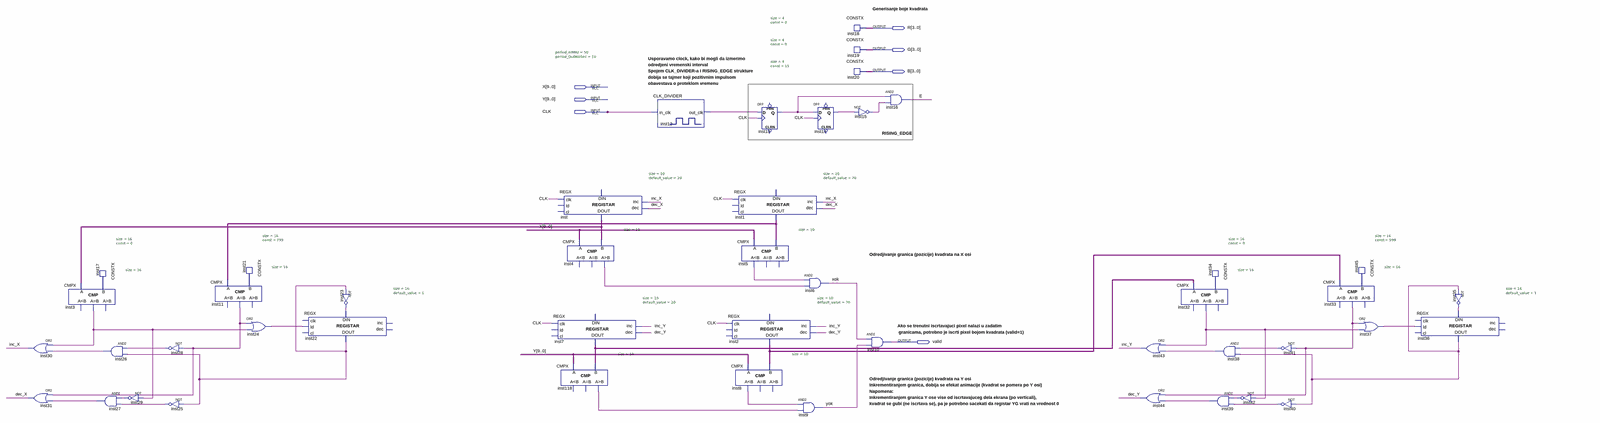
[diagram p0: schematic sheet, whole]
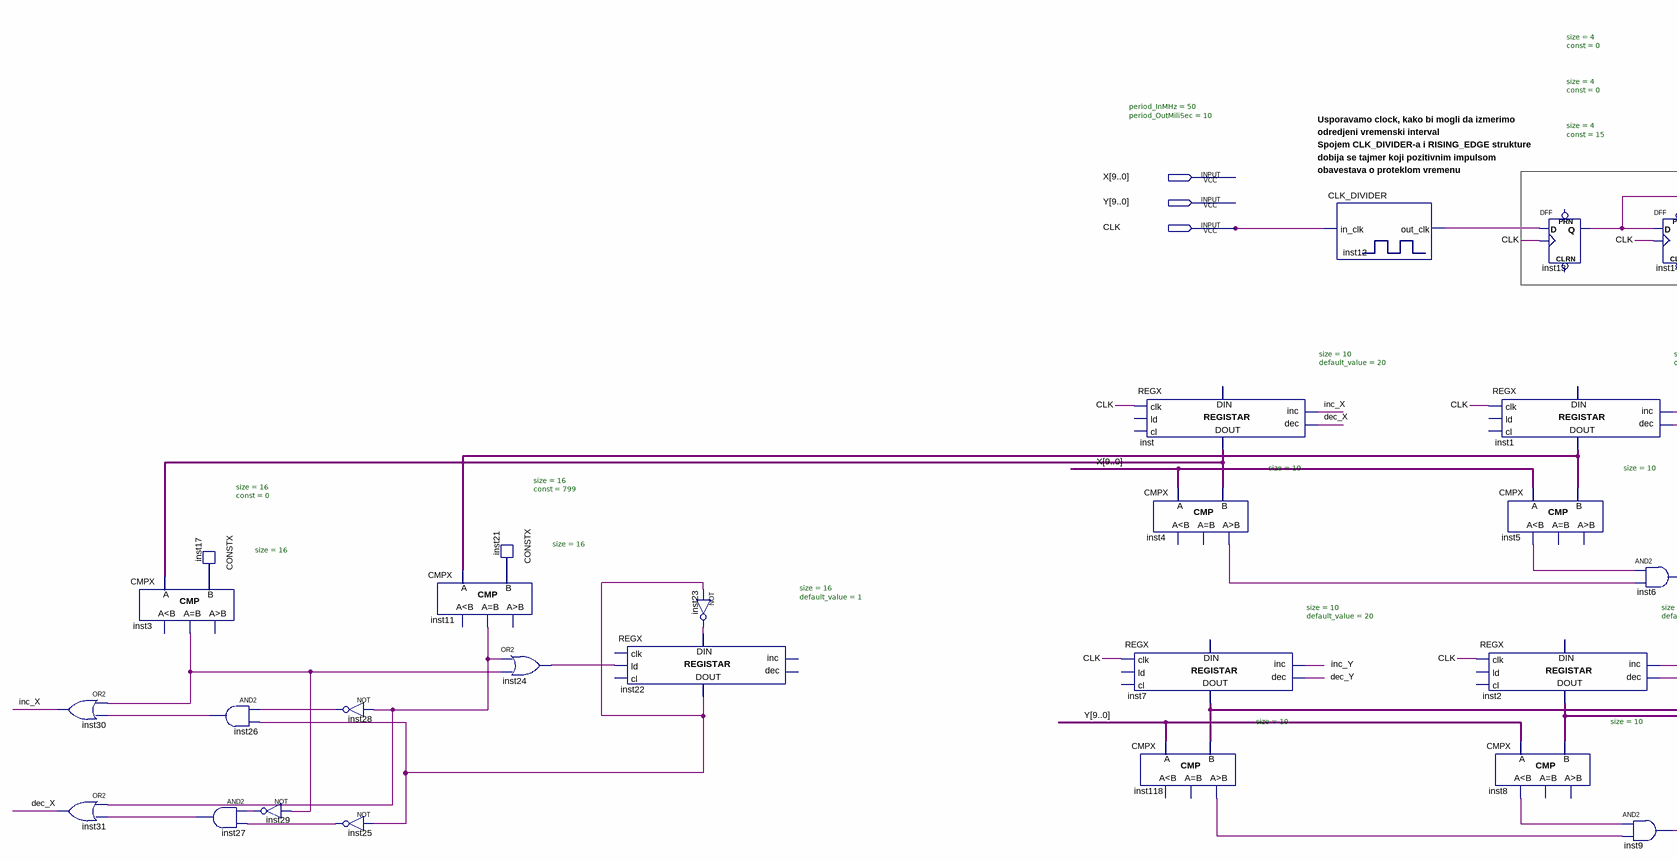
[diagram p1: schematic sheet, left part]
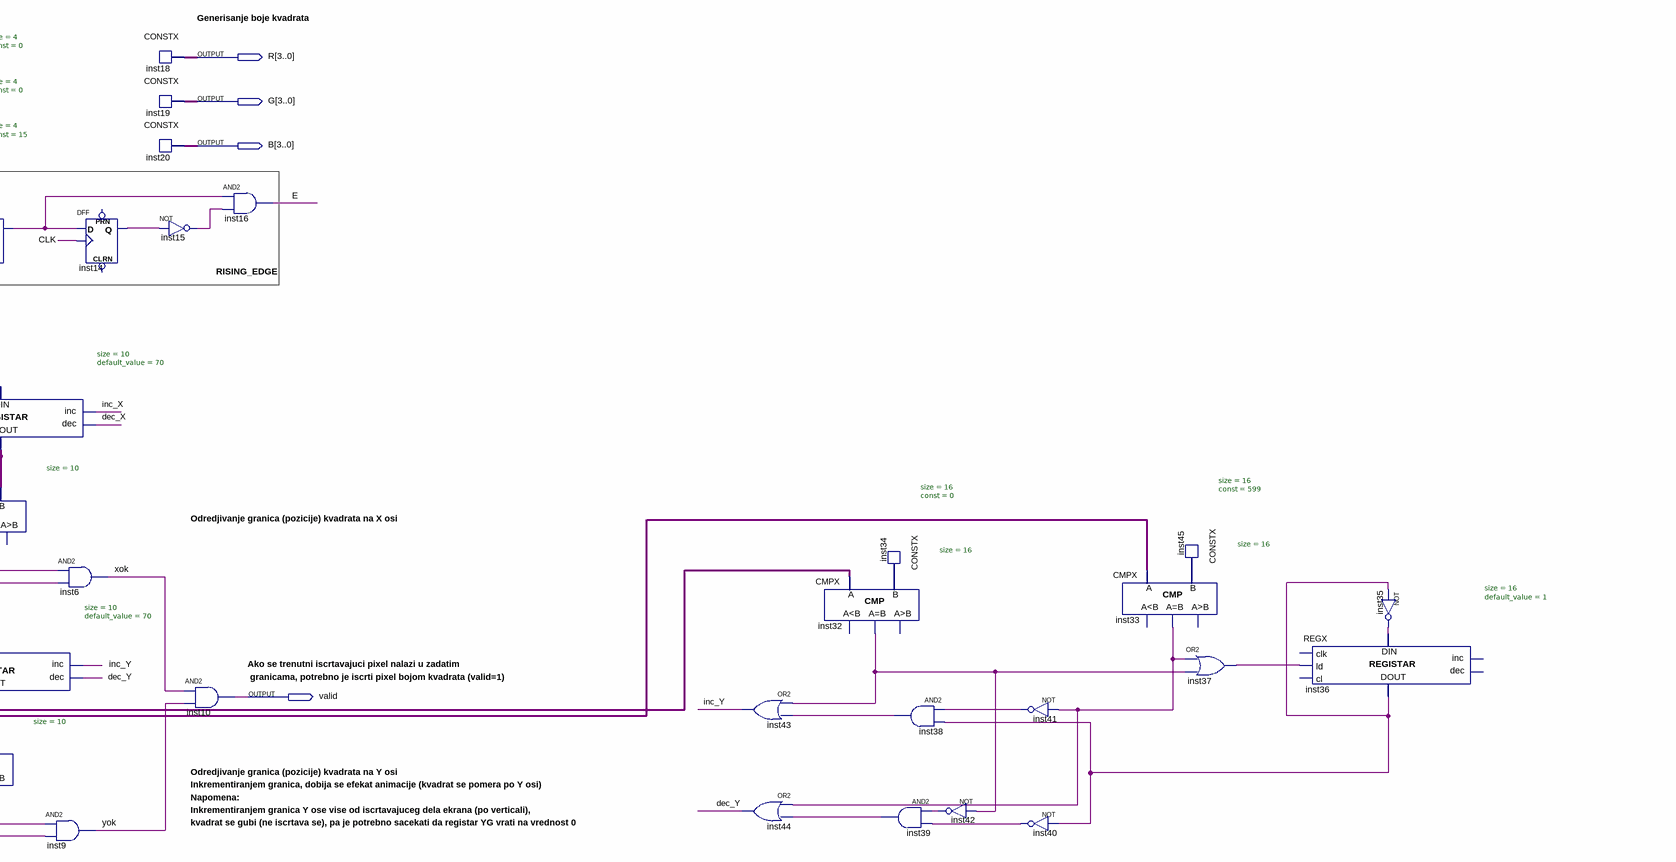
[diagram p2: schematic sheet, right part]
// Quartus schematic Pokusaj_odbijanja.bdf as structural Verilog: 47 symbols, 7 pins
module Pokusaj_odbijanja (
  input  [9:0] X,
  input  [9:0] Y,
  input  CLK,
  output [3:0] R,
  output [3:0] G,
  output [3:0] B,
  output valid
);

  wire dec_X, dec_Y, E, inc_X, inc_Y, inst3_eq, inst4_gr, inst5_ls, inst8_ls, inst11_eq, inst12_out_clk,
       inst13_q, inst14_q, inst15_out, inst22_data_out, inst23_out, inst24_out, inst25_out, inst26_out,
       inst27_out, inst28_out, inst29_out, inst32_eq, inst33_eq, inst35_out, inst36_data_out, inst37_out,
       inst38_out, inst39_out, inst40_out, inst41_out, inst42_out, inst118_gr, xok, yok;
  wire [15:0] inst1_data_out, inst2_data_out, inst7_data_out, inst17_data, inst21_data, inst34_data,
       inst45_data, inst_data_out;

  or inst30 (inc_X, inst3_eq, inst26_out);
  or inst31 (dec_X, inst11_eq, inst27_out);
  CMPX #(.size(16)) inst3 (.A(inst_data_out), .B(inst17_data), .eq(inst3_eq));  // open: ls, gr
  CONSTX #(.size(16), .\const (0)) inst17 (.data(inst17_data));
  and inst26 (inst26_out, inst28_out, inst22_data_out);
  and inst27 (inst27_out, inst29_out, inst25_out);
  not inst29 (inst29_out, inst3_eq);
  not inst28 (inst28_out, inst11_eq);
  not inst25 (inst25_out, inst22_data_out);
  CMPX #(.size(16)) inst11 (.A(inst1_data_out), .B(inst21_data), .eq(inst11_eq));  // open: ls, gr
  CONSTX #(.size(16), .\const (799)) inst21 (.data(inst21_data));
  or inst24 (inst24_out, inst11_eq, inst3_eq);
  REGX #(.size(16), .default_value(1)) inst22 (
    .ld(inst24_out), .data_in({16{inst23_out}}), .data_out(inst22_data_out));  // open: clk, cl, inc, dec
  not inst23 (inst23_out, inst22_data_out);
  REGX #(.size(10), .default_value(20)) inst7 (
    .clk(CLK), .inc(inc_Y), .dec(dec_Y), .data_out(inst7_data_out));  // open: ld, cl, data_in
  CMPX #(.size(10)) inst118 (.A(Y), .B(inst7_data_out), .gr(inst118_gr));  // open: ls, eq
  REGX #(.size(10), .default_value(20)) inst (
    .clk(CLK), .inc(inc_X), .dec(dec_X), .data_out(inst_data_out));  // open: ld, cl, data_in
  CMPX #(.size(10)) inst4 (.A(X), .B(inst_data_out), .gr(inst4_gr));  // open: ls, eq
  CLK_DIVIDER #(.period_InMHz(50), .period_OutMiliSec(10)) inst12 (.in_clk(CLK), .out_clk(inst12_out_clk));
  REGX #(.size(10), .default_value(70)) inst2 (
    .clk(CLK), .inc(inc_Y), .dec(dec_Y), .data_out(inst2_data_out));  // open: ld, cl, data_in
  CMPX #(.size(10)) inst8 (.A(Y), .B(inst2_data_out), .ls(inst8_ls));  // open: eq, gr
  REGX #(.size(10), .default_value(70)) inst1 (
    .clk(CLK), .inc(inc_X), .dec(dec_X), .data_out(inst1_data_out));  // open: ld, cl, data_in
  CMPX #(.size(10)) inst5 (.A(X), .B(inst1_data_out), .ls(inst5_ls));  // open: eq, gr
  DFF inst13 (.CLK(CLK), .D(inst12_out_clk), .Q(inst13_q));  // open: CLRN, PRN
  and inst6 (xok, inst5_ls, inst4_gr);
  and inst9 (yok, inst8_ls, inst118_gr);
  DFF inst14 (.CLK(CLK), .D(inst13_q), .Q(inst14_q));  // open: CLRN, PRN
  CONSTX #(.size(4), .\const (0)) inst18 (.data(R));
  CONSTX #(.size(4), .\const (0)) inst19 (.data(G));
  CONSTX #(.size(4), .\const (15)) inst20 (.data(B));
  not inst15 (inst15_out, inst14_q);
  and inst10 (valid, xok, yok);
  and inst16 (E, inst13_q, inst15_out);
  or inst43 (inc_Y, inst32_eq, inst38_out);
  or inst44 (dec_Y, inst33_eq, inst39_out);
  CMPX #(.size(16)) inst32 (.A(inst7_data_out), .B(inst34_data), .eq(inst32_eq));  // open: ls, gr
  CONSTX #(.size(16), .\const (0)) inst34 (.data(inst34_data));
  and inst38 (inst38_out, inst41_out, inst36_data_out);
  and inst39 (inst39_out, inst42_out, inst40_out);
  not inst42 (inst42_out, inst32_eq);
  not inst41 (inst41_out, inst33_eq);
  not inst40 (inst40_out, inst36_data_out);
  CMPX #(.size(16)) inst33 (.A(inst2_data_out), .B(inst45_data), .eq(inst33_eq));  // open: ls, gr
  CONSTX #(.size(16), .\const (599)) inst45 (.data(inst45_data));
  or inst37 (inst37_out, inst33_eq, inst32_eq);
  REGX #(.size(16), .default_value(1)) inst36 (
    .ld(inst37_out), .data_in({16{inst35_out}}), .data_out(inst36_data_out));  // open: clk, cl, inc, dec
  not inst35 (inst35_out, inst36_data_out);

  // Notes on the sheet:
  //   Generisanje boje kvadrata
  //   Usporavamo clock, kako bi mogli da izmerimo
  //   odredjeni vremenski interval
  //   Spojem CLK_DIVIDER-a i RISING_EDGE strukture
  //   dobija se tajmer koji pozitivnim impulsom 
  //   obavestava o proteklom vremenu
  //   RISING_EDGE
  //   Odredjivanje granica (pozicije) kvadrata na X osi
  //   Ako se trenutni iscrtavajuci pixel nalazi u zadatim
  //    granicama, potrebno je iscrti pixel bojom kvadrata (valid=1)
  //   Odredjivanje granica (pozicije) kvadrata na Y osi
  //   Inkrementiranjem granica, dobija se efekat animacije (kvadrat se pomera po Y osi)
  //   Napomena:
  //   Inkrementiranjem granica Y ose vise od iscrtavajuceg dela ekrana (po verticali),
  //   kvadrat se gubi (ne iscrtava se), pa je potrebno sacekati da registar YG vrati na vrednost 0
endmodule
